# EAGLE design Controller (EAGLE 9.6.2)
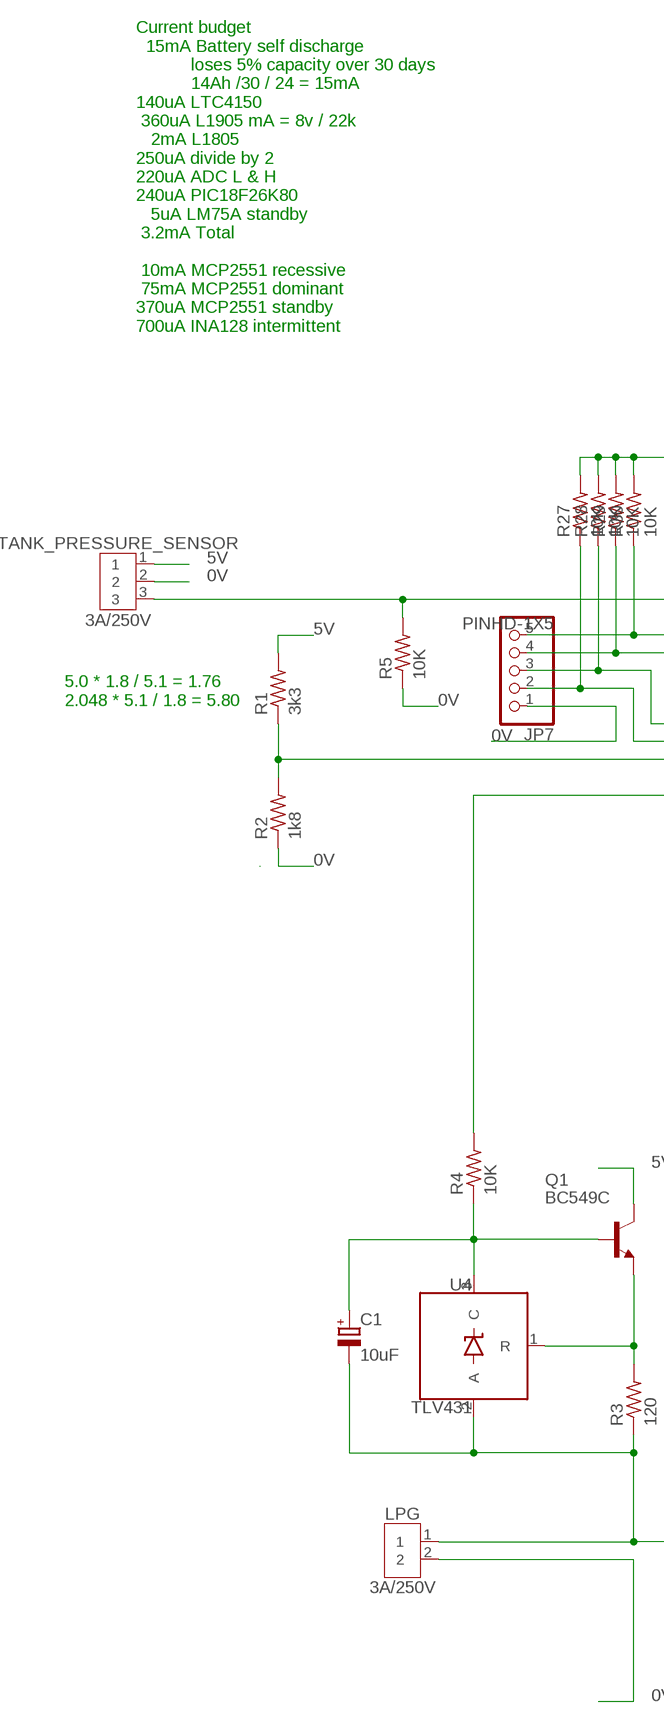
[diagram p0: schematic, sheet 1, part 1 of 2]
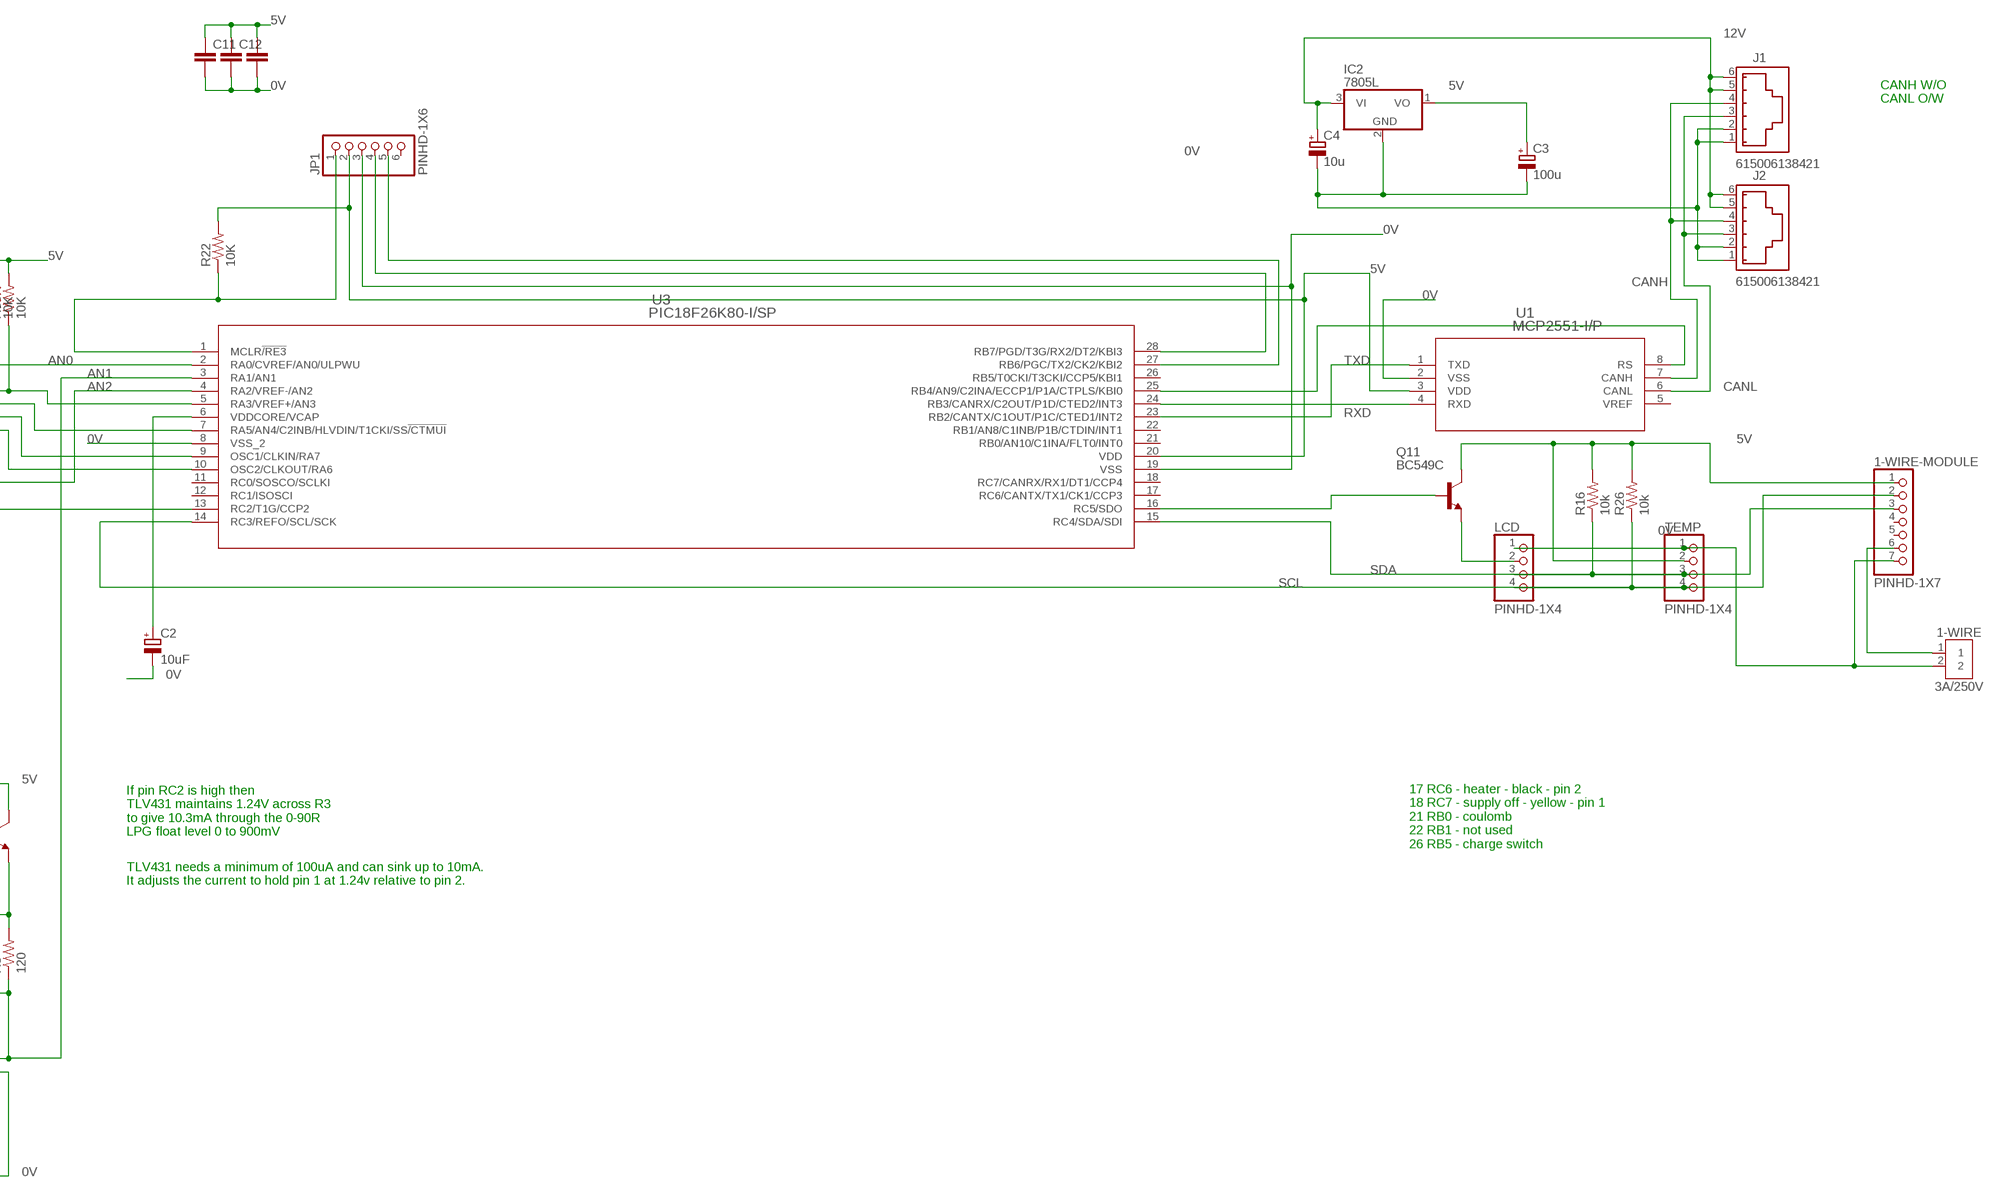
[diagram p1: schematic, sheet 1, part 2 of 2]

## Parts
1-WIRE  3A/250V  B2B-XH-A  [B2B-XH-A]
1-WIRE-MODULE  PINHD-1X7  [1X07]
C1  10uF  CPOL-EUE3.5-8  [E3,5-8]
C2  10uF  CPOL-EUE3.5-8  [E3,5-8]
C3  100u  CPOL-EUE3.5-8  [E3,5-8]
C4  10u  CPOL-EUE3.5-8  [E3,5-8]
C7  C2,5-3  [C2.5-3]
C11  C2,5-3  [C2.5-3]
C12  C2,5-3  [C2.5-3]
IC2  7805L  [TO92]
J1  615006138421  [615006138421]
J2  615006138421  [615006138421]
JP1  PINHD-1X6  [1X06]
JP7  PINHD-1X5  [1X05]
LCD  PINHD-1X4  [1X04]
LPG  3A/250V  B2B-XH-A  [B2B-XH-A]
Q1  BC549C  [TO92-EBC]
Q11  BC549C  [TO92-EBC]
R1  3k3  RES_7  [0204/7]
R2  1k8  RES_7  [0204/7]
R3  120  RES_7  [0204/7]
R4  10K  RES_7  [0204/7]
R5  10K  RES_7  [0204/7]
R16  10k  RES_7  [0204/7]
R22  10K  RES_7  [0204/7]
R26  10k  RES_7  [0204/7]
R27  10K  RES_70204/7-90  [0204/7-90]
R28  10K  RES_70204/7-90  [0204/7-90]
R29  10K  RES_70204/7-90  [0204/7-90]
R30  10K  RES_70204/7-90  [0204/7-90]
TANK_PRESSURE_SENSOR  3A/250V  B3B-XH-A  [B3B-XH-A]
TEMP  PINHD-1X4  [1X04]
U1  MCP2551-I/P  [PDIP8_300MC_MCH]
U3  PIC18F26K80-I/SP  [SPDIP28_300MC_MCH]
U4  TLV431  [TO92]

## Nets
0V: 1-WIRE-MODULE.7 1-WIRE.2 C2.- C3.- C4.- C7.2 C11.2 C12.2 IC2.2(GND) J1.1 J1.2 J2.1 J2.2 JP1.3 JP7.1 LCD.1 LPG.2 R2.1 R5.1 TANK_PRESSURE_SENSOR.2 TEMP.1 U1.2(VSS) U3.8(VSS_2) U3.19(VSS)
5V: 1-WIRE-MODULE.1 C3.+ C7.1 C11.1 C12.1 IC2.1(VO) JP1.2 Q1.C Q11.C R1.2 R16.2 R22.2 R26.2 R27.2 R28.2 R29.2 R30.2 TANK_PRESSURE_SENSOR.1 TEMP.2 U1.3(VDD) U3.20(VDD)
12V: C4.+ IC2.3(VI) J1.5 J1.6 J2.5 J2.6
AN0: R5.2 TANK_PRESSURE_SENSOR.3 U3.2(RA0/CVREF/AN0/ULPWU)
AN1: C1.- LPG.1 R3.1 U3.3(RA1/AN1) U4.2(A)
AN2: R1.1 R2.2 U3.4(RA2/VREF-/AN2)
CANH: J1.4 J2.4 U1.7(CANH)
CANL: J1.3 J2.3 U1.6(CANL)
N$5: JP1.1 R22.1 U3.1(MCLR!/RE3)
N$6: LCD.2 Q11.E
N$8: JP1.4 U3.28(RB7/PGD/T3G/RX2/DT2/KBI3)
N$9: JP1.5 U3.27(RB6/PGC/TX2/CK2/KBI2)
N$10: R4.2 U3.13(RC2/T1G/CCP2)
N$12: 1-WIRE-MODULE.6 1-WIRE.1
N$13: Q1.E R3.2 U4.1(R)
N$14: C2.+ U3.6(VDDCORE/VCAP)
N$16: C1.+ Q1.B R4.1 U4.3(C)
N$35: Q11.B U3.16(RC5/SDO)
N$36: JP7.5 R30.1 U3.5(RA3/VREF+/AN3)
N$45: JP7.4 R29.1 U3.7(RA5/AN4/C2INB/HLVDIN/T1CKI/SS!/CTMUI)
N$46: JP7.3 R28.1 U3.9(OSC1/CLKIN/RA7)
N$47: JP7.2 R27.1 U3.10(OSC2/CLKOUT/RA6)
N$54: U1.8(RS) U3.25(RB4/AN9/C2INA/ECCP1/P1A/CTPLS/KBI0)
RXD: U1.4(RXD) U3.24(RB3/CANRX/C2OUT/P1D/CTED2/INT3)
SCL: 1-WIRE-MODULE.2 LCD.4 R26.1 TEMP.4 U3.14(RC3/REFO/SCL/SCK)
SDA: 1-WIRE-MODULE.3 LCD.3 R16.1 TEMP.3 U3.15(RC4/SDA/SDI)
TXD: U1.1(TXD) U3.23(RB2/CANTX/C1OUT/P1C/CTED1/INT2)
Unconnected: 1-WIRE-MODULE.4 1-WIRE-MODULE.5 JP1.6 U1.5(VREF) U3.11(RC0/SOSCO/SCLKI) U3.12(RC1/ISOSCI) U3.17(RC6/CANTX/TX1/CK1/CCP3) U3.18(RC7/CANRX/RX1/DT1/CCP4) U3.21(RB0/AN10/C1INA/FLT0/INT0) U3.22(RB1/AN8/C1INB/P1B/CTDIN/INT1) U3.26(RB5/T0CKI/T3CKI/CCP5/KBI1)

## Notes on the sheet
- CANH W/O
  CANL O/W
- Current budget
    15mA Battery self discharge
             loses 5% capacity over 30 days
             14Ah /30 / 24 = 15mA
  140uA LTC4150
   360uA L1905 mA = 8v / 22k
     2mA L1805
  250uA divide by 2
  220uA ADC L & H
  240uA PIC18F26K80
     5uA LM75A standby
   3.2mA Total
  
   10mA MCP2551 recessive
   75mA MCP2551 dominant
  370uA MCP2551 standby
  700uA INA128 intermittent
- 5.0 * 1.8 / 5.1 = 1.76
  2.048 * 5.1 / 1.8 = 5.80
- If pin RC2 is high then
  TLV431 maintains 1.24V across R3
  to give 10.3mA through the 0-90R
  LPG float level 0 to 900mV
- TLV431 needs a minimum of 100uA and can sink up to 10mA.
  It adjusts the current to hold pin 1 at 1.24v relative to pin 2.
- 17 RC6 - heater - black - pin 2
  18 RC7 - supply off - yellow - pin 1
  21 RB0 - coulomb
  22 RB1 - not used
  26 RB5 - charge switch

## Library data of the parts
1-WIRE LPG = andrew-boyson:B2B-XH-A: XH Connector Top Entry - 2POS Details see: Datasheet <http://www.jst-mfg.com/product/pdf/eng/eXH.pdf>; CATEGORY: CONNECTOR; DESCRIPTION: 2.5mm pitch/disconnectable crimp style connector; MANUFACTURER: JST (XH CONNECTOR); MPN: B2B-XH-A; OPERATING_TEMPERATURE: -25°C ~ 85°C; PART_STATUS: ACTIVE; ROHS_COMPLIANT: COMPLIANT; SERIES: B_B-XH-A; SUB_CATEGORY: Through hole connector; TYPE: top entry
1-WIRE-MODULE = Connector:PINHD-1X7: PIN HEADER; CATEGORY: CONNECTOR; SUB-CATEGORY: PIN-HEADER
C1-C4 = andrew-boyson:CPOL-EU: POLARIZED CAPACITOR, European symbol; SPICEPREFIX: C
C7 C11 C12 = capacitor-wima:C: CAPACITOR naming: grid - package width
IC2 = adafruit:78*: Positive VOLTAGE REGULATOR Added bigger pads to the TO-92 package
J1 J2 = Wurth_Connectors_WR-MJ:615006138421: WR-MJ Modular Jack Horizontal Plastic 6PxC Tab Up KIND PROPERTIES Quality Class:500 Mating cycles General Information Operating Temperature:-40 up to +85 °C Compliance: RoHS Electrical Properties IR 1:1.5A Working Voltage:120V (AC) Withstanding Voltage:1000V (AC) Contact Resistance:20mΩ RISO:500 MΩ Material Properties Insulator MateriaL:PBT Insulator Flammability Rating:UL94 V-0 Color:Black Contact Material Copper Alloy Contact Plating:Gold Contact Type:Stamped Packaging Properties Packaging:Tray <https://www.we-online.com/catalog/media/o33138v209%20Family_WR-MJ_61500x138421.jpg> Details see: https://www.we-online.com/catalog/en/MJ_HORIZONTAL_PLASTIC_6PXC_TAB_UP/? Updated by Yingchun,Shan 2020-01-06 2020 (C) Würth Elektronik; DATASHEET-URL: https://www.we-online.com/catalog/datasheet/615006138421.pdf; MOUNT: THT; PART-NUMBER: 615006138421; TYPE: Horizontal; XPXC: 6P6C
JP1 = Connector:PINHD-1X6: PIN HEADER; CATEGORY: CONNECTOR; SUB-CATEGORY: PIN-HEADER
JP7 = Connector:PINHD-1X5: PIN HEADER; CATEGORY: CONNECTOR; SUB-CATEGORY: PIN-HEADER
LCD TEMP = Connector:PINHD-1X4: PIN HEADER; CATEGORY: CONNECTOR; SUB-CATEGORY: PIN-HEADER
Q1 Q11 = transistor-npn:BC549*: NPN Transistor
R1-R5 R16 R22 R26-R30 = andrew-boyson:RES_7: RESISTOR, American symbol
TANK_PRESSURE_SENSOR = andrew-boyson:B3B-XH-A: XH Connector Top Entry - 3POS Details see: Datasheet <http://www.jst-mfg.com/product/pdf/eng/eXH.pdf>; CATEGORY: CONNECTOR; DESCRIPTION: 2.5mm pitch/disconnectable crimp style connector; MANUFACTURER: JST (XH connector); MPN: B3B-XH-A; PART_STATUS: ACTIVE; ROHS_COMPLIANT: COMPLIANT; SERIES: B3B-XH-A; SUB_CATEGORY: THROUGH HOLE CONNECTOR; TYPE: SIDE ENTRY
U1 = andrew-boyson:MCP2551-I/P; COPYRIGHT: Copyright (C) 2021 Ultra Librarian. All rights reserved.; MANUFACTURER_PART_NUMBER: MCP2551-I/P; MFR_NAME: Microchip
U3 = andrew-boyson:PIC18F26K80-I/SP; COPYRIGHT: Copyright (C) 2021 Ultra Librarian. All rights reserved.; MANUFACTURER_PART_NUMBER: pic18f26k80-i/sp; MFR_NAME: Microchip
U4 = andrew-boyson:TLV431: TLV431

## Board
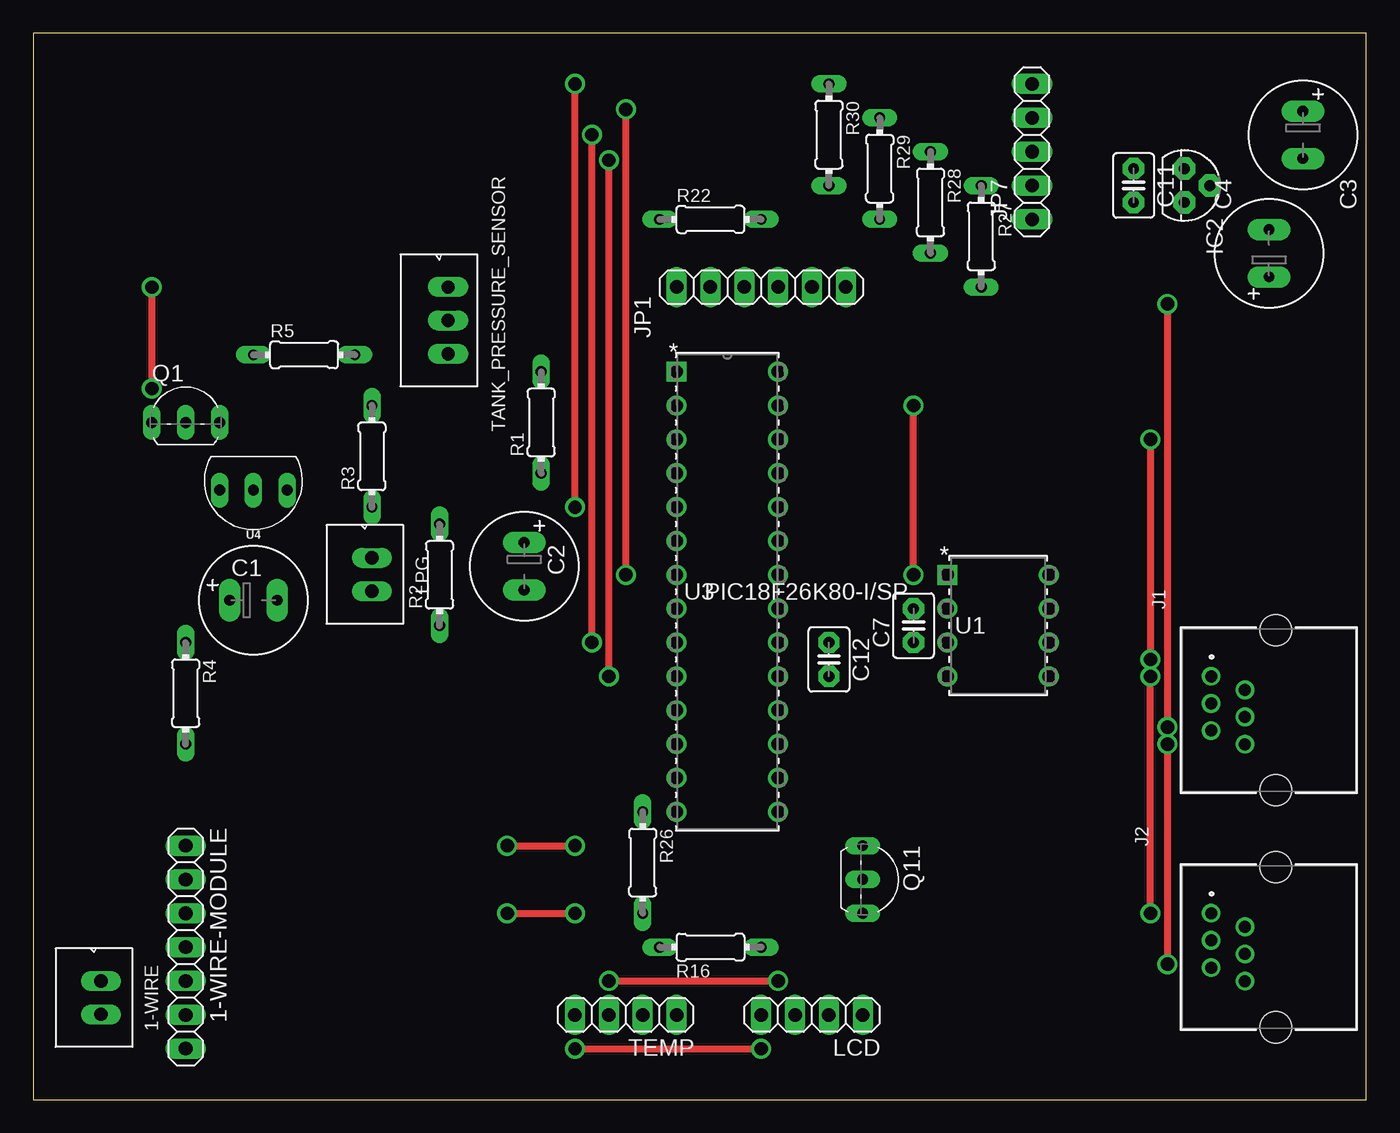
[diagram p2: board, top side]
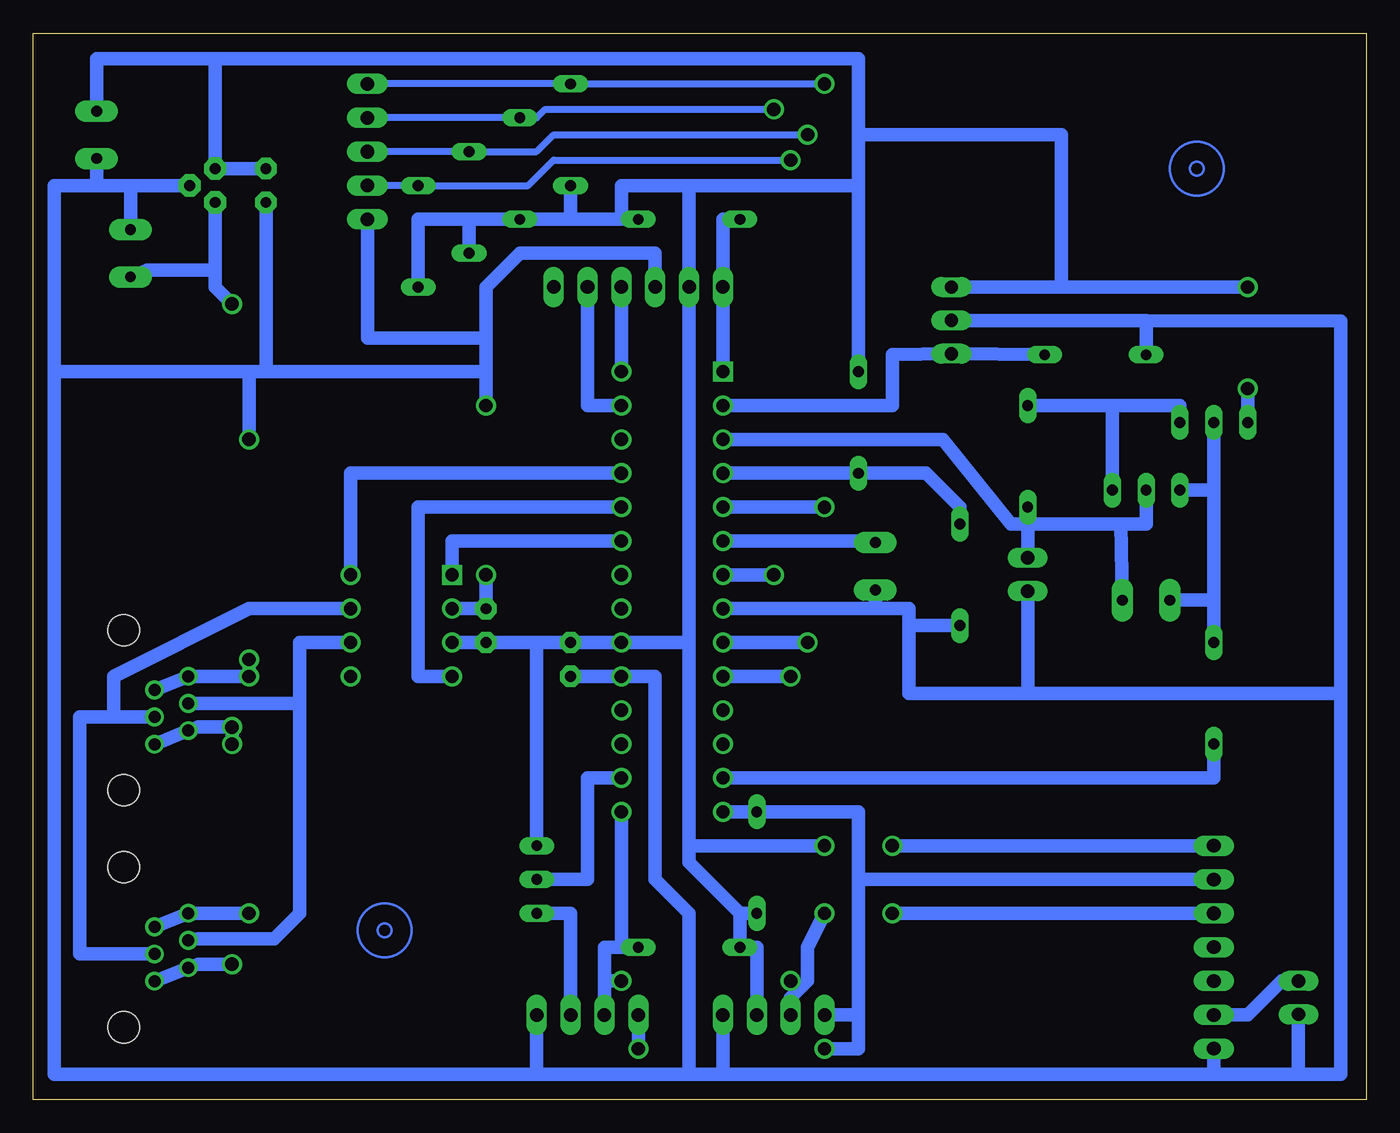
[diagram p3: board, bottom side, seen from below]

Size 100 x 80 mm. Coordinates in mm from the lower left corner, seen from the top.
Outline: 0,0 100,0 100,80 0,80 0,0
Copper layers (1*16): Top 0.035mm / dielectric 1.5mm / Bottom 0.035mm
Design rules "default": minimum track width 6mil, minimum drill 0.35mm, track to track 6mil, track to pad 6mil, pad to pad 6mil, via to via 6mil, smd to smd 6mil, copper to edge 40mil, drill to drill 6mil, minimum pad ring 10mil, minimum via ring 8mil, stop-mask expansion 4mil, vias tented up to drill 0mil, thermal gap 10mil
tKeepout: area 9.4,2 to 31.4,21

### Footprints (pad centres in the part's own frame; a part is rotated, then mirrored left to right if it is on the bottom)
B2B-XH-A = drill 1 long: 1 0,0; 2 2.5,0
1X07 = drill 1.016 long: 1 -7.62,0; 2 -5.08,0; 3 -2.54,0; 4 0,0; 5 2.54,0; 6 5.08,0; 7 7.62,0
E3,5-8 = drill 0.813 pad 1.6 long: + -1.778,0; - 1.778,0
C2.5-3 = drill 0.813 pad 1.6 octagon: 1 -1.27,0; 2 1.27,0
TO92 = drill 0.813 pad 1.676 octagon: 1 -1.27,0; 2 0,1.905; 3 1.27,0
615006138421 = drill 0.9: 1 2.55,4.34; 2 1.53,1.8; 3 0.51,4.34; 4 -0.51,1.8; 5 -1.53,4.34; 6 -2.55,1.8 | hole 2.36: -6,-0.5; 6,-0.5
1X06 = drill 1.016 long: 1 -6.35,0; 2 -3.81,0; 3 -1.27,0; 4 1.27,0; 5 3.81,0; 6 6.35,0
1X05 = drill 1.016 long: 1 -5.08,0; 2 -2.54,0; 3 0,0; 4 2.54,0; 5 5.08,0
1X04 = drill 1.016 long: 1 -3.81,0; 2 -1.27,0; 3 1.27,0; 4 3.81,0
TO92-EBC = drill 0.813 long: B 0,-1.27; C -2.54,-1.27; E 2.54,-1.27
0204/7 = drill 0.813 long: 1 -3.81,0; 2 3.81,0
0204/7-90 = drill 0.813 long: 1 -3.81,0; 2 3.81,0
B3B-XH-A = drill 1 long: 1 0,1.27; 2 2.5,1.27; 3 5,1.27
PDIP8_300MC_MCH = drill 0.991 pad 1.499 square: 1 0,0 | drill 0.991 pad 1.499: 2 0,-2.54; 3 0,-5.08; 4 0,-7.62; 5 7.62,-7.62; 6 7.62,-5.08; 7 7.62,-2.54; 8 7.62,0
SPDIP28_300MC_MCH = drill 0.991 pad 1.499 square: 1 0,0 | drill 0.991 pad 1.499: 2 0,-2.54; 3 0,-5.08; 4 0,-7.62; 5 0,-10.16; 6 0,-12.7; 7 0,-15.24; 8 0,-17.78; 9 0,-20.32; 10 0,-22.86; 11 0,-25.4; 12 0,-27.94; 13 0,-30.48; 14 0,-33.02; 15 7.62,-33.02; 16 7.62,-30.48; 17 7.62,-27.94; 18 7.62,-25.4; 19 7.62,-22.86; 20 7.62,-20.32; 21 7.62,-17.78; 22 7.62,-15.24; 23 7.62,-12.7; 24 7.62,-10.16; 25 7.62,-7.62; 26 7.62,-5.08; 27 7.62,-2.54; 28 7.62,0
TO92' = drill 0.813 long: 1 -2.54,0; 2 0,0; 3 2.54,0

### Placement (x,y rotation side)
1-WIRE  5.08,8.89 270 top
1-WIRE-MODULE  11.43,11.43 270 top
C1  16.51,37.47 0 top
C2  36.83,40.01 270 top
C3  95.25,72.39 270 top
C4  92.71,63.5 90 top
C7  66.04,35.56 90 top
C11  82.55,68.58 270 top
C12  59.69,33.02 270 top
IC2  86.36,68.58 270 top
J1  92.71,29.21 90 top
J2  92.71,11.43 90 top
JP1  54.61,60.96 0 top
JP7  74.93,71.12 90 top
LCD  58.42,6.35 180 top
LPG  25.4,40.64 270 top
Q1  11.43,52.07 0 top
Q11  63.5,16.51 270 top
R1  38.1,50.8 90 top
R2  30.48,39.37 90 top
R3  25.4,48.26 90 top
R4  11.43,30.48 270 top
R5  20.32,55.88 0 top
R16  50.8,11.43 180 top
R22  50.8,66.04 0 top
R26  45.72,17.78 270 top
R27  71.12,64.77 270 top
R28  67.31,67.31 270 top
R29  63.5,69.85 270 top
R30  59.69,72.39 270 top
TANK_PRESSURE_SENSOR  29.84,60.96 270 top
TEMP  44.45,6.35 180 top
U1  68.58,39.37 0 top
U3  48.26,54.61 0 top
U4  TLV431  [TO92']  16.51,45.72 180 top

### Tracks (layer width: path | path; a pad name or v marks a point on that pad's centre or on a via)
0V  (via drill 1)
  Top 0.508: v66.04,39.37 v66.04,52.07 | v83.82,13.97 v83.82,31.75 | v83.82,49.53 v83.82,33.02
  Bottom 1.016: 1.91,30.48 1.91,1.91 5.08,1.91 | 1.91,30.48 1.91,58.42 16.51,58.44 | 11.43,1.91 5.08,1.91 | 11.43,1.91 48.26,1.91 | 48.26,1.91 50.8,1.91 | 50.8,1.91 62.23,1.91 | JP1.3 53.34,63.5 63.5,63.5 66.04,60.96 66.04,57.15 | TEMP.1 48.26,1.91 | v66.04,39.37 C7.2 U1.2 | C12.2 U3.19 53.34,31.75 53.34,16.51 50.8,13.97 50.8,1.91 | LCD.1 62.23,1.91 | JP7.1 74.93,57.15 66.04,57.15 | U3.8 36.83,36.83 | 36.83,36.83 34.29,36.83 34.29,35.56 | C2.- 36.83,36.83 | 62.23,1.91 98.42,1.91 98.42,54.61 | 66.04,57.15 66.04,54.61 | 66.04,54.61 v66.04,52.07 | 34.29,35.56 34.29,30.48 25.4,30.48 | 25.4,30.48 1.91,30.48 | J1.2 J1.1 v83.82,31.75 v83.82,33.02 | J2.2 J2.1 v83.82,13.97 | 66.04,54.61 82.55,54.61 | 82.55,54.61 83.82,54.61 | 83.82,54.61 98.42,54.61 | 98.42,54.61 98.42,68.58 95.25,68.58 | IC2.2 92.71,68.58 | 92.71,68.58 95.25,68.58 | C11.2 82.55,54.61 | 1-WIRE.2 5.08,1.91 | 1-WIRE-MODULE.7 11.43,1.91 | v83.82,49.53 83.82,54.61 | C3.- 95.25,68.58 | LPG.2 25.4,30.48 | TANK_PRESSURE_SENSOR.2 16.51,58.44 | C4.- 92.71,68.58 | R5.1 16.51,58.44 | R2.1 34.29,35.56
5V  (via drill 1)
  Top 0.508: v35.56,19.05 v40.64,19.05 | v8.89,60.96 v8.89,53.34
  Bottom 1.016: 50.8,34.29 JP1.2 50.8,68.58 | 62.23,34.29 C12.1 U3.20 50.8,34.29 | 62.23,34.29 Q11.C | U1.3 C7.1 62.23,34.29 | 50.8,34.29 50.8,19.05 | 50.8,19.05 50.8,17.78 46.99,13.97 | TEMP.2 45.72,11.43 R16.2 46.99,13.97 | 38.1,68.58 50.8,68.58 | 50.8,68.58 55.88,68.58 55.88,66.04 | R22.2 55.88,66.04 | 55.88,66.04 59.69,66.04 | 59.69,66.04 R29.2 67.31,66.04 | R30.2 59.69,66.04 | 67.31,66.04 71.12,66.04 R27.2 | R28.2 67.31,66.04 | 38.1,68.58 38.1,72.39 | 38.1,72.39 38.1,78.11 86.36,78.11 | 86.36,78.11 95.25,78.11 C3.+ | 86.36,78.11 IC2.1 C11.1 | TANK_PRESSURE_SENSOR.1 22.86,60.96 | 22.86,60.96 22.86,72.39 38.1,72.39 | 22.86,60.96 v8.89,60.96 | Q1.C v8.89,53.34 | v35.56,19.05 1-WIRE-MODULE.1 | 46.99,13.97 R26.2 | v40.64,19.05 50.8,19.05 | R1.2 38.1,68.58
12V  (via drill 1)
  Top 0.508: v85.09,59.69 v85.09,27.94 | v85.09,26.67 v85.09,10.16
  Bottom 1.016: J2.6 J2.5 87.63,10.16 v85.09,10.16 | J1.6 J1.5 87.63,27.94 v85.09,27.94 v85.09,26.67 | v85.09,59.69 86.36,60.96 86.36,62.23 | 86.36,62.23 IC2.3 | C4.+ 91.44,62.23 86.36,62.23
AN0
  Bottom 1.016: U3.2 35.56,52.07 35.56,55.88 TANK_PRESSURE_SENSOR.3 | TANK_PRESSURE_SENSOR.3 30.48,55.88 | R5.2 TANK_PRESSURE_SENSOR.3
AN1
  Bottom 1.016: R3.1 25.4,43.18 | LPG.1 25.4,43.18 | U3.3 31.75,49.53 26.67,43.18 25.4,43.18 | U4.2 16.51,43.18 18.41,43.18 | 25.4,43.18 18.41,43.18 | C1.- 18.41,43.18
AN2
  Bottom 1.016: U3.4 R1.1 33.02,46.99 30.48,44.45 R2.2
CANH
  Bottom 1.016: J1.4 92.71,28.7 93.98,28.7 | J2.4 92.71,10.92 96.52,10.92 96.52,28.7 93.98,28.7 | 93.98,28.7 93.98,31.75 83.82,36.83 U1.7
CANL
  Bottom 1.016: U1.6 80.01,34.29 80.01,29.72 | 80.01,29.72 80.01,13.97 81.92,12.06 87.63,12.06 J2.3 | J1.3 80.01,29.72
N$5
  Bottom 1.016: R22.1 48.26,66.04 48.26,63.5 JP1.1 U3.1
N$6
  Bottom 1.016: LCD.2 59.69,13.97 Q11.E
N$8
  Bottom 1.016: JP1.4 U3.28
N$9
  Bottom 1.016: JP1.5 58.42,52.07 U3.27
N$10
  Bottom 1.016: U3.13 11.43,24.13 R4.2
N$12
  Bottom 1.016: 1-WIRE-MODULE.6 8.89,6.35 6.35,8.89 1-WIRE.1
N$13
  Bottom 1.016: R3.2 19.05,52.07 | 19.05,52.07 13.97,52.07 Q1.E | U4.1 19.05,52.07
N$14
  Bottom 1.016: U3.6 38.1,41.91 C2.+
N$16
  Bottom 1.016: Q1.B 11.43,45.72 | 11.43,45.72 11.43,37.47 | 11.43,37.47 R4.1 | U4.3 11.43,45.72 | C1.+ 11.43,37.47
N$35
  Bottom 1.016: Q11.B 58.42,16.51 58.42,24.13 U3.16
N$36  (via drill 1)
  Top 0.508: v40.64,44.45 v40.64,76.2
  Bottom 0.508: JP7.5 R30.1 v40.64,76.2
  Bottom 1.016: U3.5 v40.64,44.45
N$45  (via drill 1)
  Top 0.508: v44.45,39.37 v44.45,74.3
  Bottom 0.508: JP7.4 R29.1 62.23,73.66 61.59,74.3 v44.45,74.3
  Bottom 1.016: U3.7 v44.45,39.37
N$46  (via drill 1)
  Top 0.508: v41.91,34.29 v41.91,72.39
  Bottom 0.508: JP7.3 R28.1 62.23,71.12 60.96,72.39 v41.91,72.39
  Bottom 1.016: U3.9 v41.91,34.29
N$47  (via drill 1)
  Top 0.508: v43.18,31.75 v43.18,70.48
  Bottom 0.508: JP7.2 R27.1 62.87,68.58 60.96,70.48 v43.18,70.48
  Bottom 1.016: U3.10 v43.18,31.75
N$54
  Bottom 1.016: U1.8 76.2,46.99 U3.25
RXD
  Bottom 1.016: U1.4 71.12,31.75 71.12,44.45 U3.24
SCL  (via drill 1)
  Top 0.508: v40.64,3.81 v54.61,3.81
  Bottom 1.016: v54.61,3.81 LCD.4 | 38.1,6.35 TEMP.4 | v40.64,3.81 38.1,3.81 38.1,6.35 | 38.1,16.51 1-WIRE-MODULE.2 | U3.14 R26.1 38.1,21.59 38.1,16.51 | 38.1,6.35 38.1,16.51
SDA  (via drill 1)
  Top 0.508: v43.18,8.89 v55.88,8.89 | v35.56,13.97 v40.64,13.97
  Bottom 1.016: 55.88,11.43 R16.1 | LCD.3 57.15,8.89 | v55.88,8.89 57.15,8.89 | 57.15,8.89 57.15,11.43 55.88,11.43 | U3.15 55.88,11.43 | TEMP.3 43.18,7.62 42.55,8.26 | 42.55,8.26 41.91,8.89 41.91,11.43 v40.64,13.97 | v43.18,8.89 42.55,8.26 | v35.56,13.97 1-WIRE-MODULE.3
TXD
  Bottom 1.016: U1.1 68.58,41.91 U3.23
(copper drawn outside any net)
  shapes: Bottom circle x4